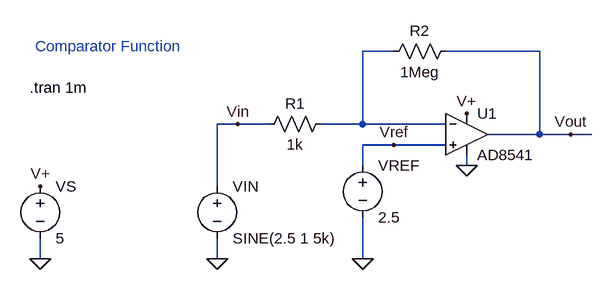
[diagram p0: schematic AD8541.asc]
AD8541.asc, the LTspice schematic file:
Version 4
SHEET 1 884 680
WIRE -160 144 -208 144
WIRE 64 144 -80 144
WIRE -400 256 -432 256
WIRE -352 256 -400 256
WIRE -208 256 -208 144
WIRE -208 256 -272 256
WIRE -80 256 -208 256
WIRE 64 272 64 144
WIRE 64 272 -16 272
WIRE 112 272 64 272
WIRE 144 272 112 272
WIRE -160 288 -208 288
WIRE -80 288 -160 288
WIRE -208 320 -208 288
WIRE -48 320 -48 304
WIRE -432 352 -432 256
WIRE -704 464 -704 432
WIRE -432 464 -432 432
WIRE -208 464 -208 400
FLAG -208 464 0
FLAG -704 464 0
FLAG -704 352 V+
FLAG -48 240 V+
FLAG -160 288 Vref
FLAG 112 272 Vout
FLAG -432 464 0
FLAG -400 256 Vin
FLAG -48 320 0
SYMBOL voltage -208 304 R0
WINDOW 123 0 0 Left 0
WINDOW 39 0 0 Left 0
SYMATTR InstName VREF
SYMATTR Value 2.5
SYMBOL voltage -704 336 R0
WINDOW 123 0 0 Left 0
WINDOW 39 0 0 Left 0
SYMATTR InstName VS
SYMATTR Value 5
SYMBOL AD8541 -48 208 R0
SYMATTR InstName U1
SYMBOL res -64 128 R90
WINDOW 0 0 56 VBottom 2
WINDOW 3 32 56 VTop 2
SYMATTR InstName R2
SYMATTR Value 1Meg
SYMBOL voltage -432 336 R0
WINDOW 123 0 0 Left 0
WINDOW 39 0 0 Left 0
SYMATTR InstName VIN
SYMATTR Value SINE(2.5 1 5k)
SYMBOL res -256 240 R90
WINDOW 0 0 56 VBottom 2
WINDOW 3 32 56 VTop 2
SYMATTR InstName R1
SYMATTR Value 1k
TEXT -720 200 Left 2 !.tran 1m
TEXT -712 136 Left 2 ;Comparator Function

The netlist it stands for:
* AD8541.asc
VREF Vref 0 2.5
VS V+ 0 5
* U1: AD8541 (symbol AD8541 not available, pins judged from their places): In+=Vref In-=N001 V+=V+ V-=0 OUT=Vout
R2 Vout N001 1Meg
VIN Vin 0 SINE(2.5 1 5k)
R1 N001 Vin 1k
.tran 1m
* Comparator Function
.backanno
.end